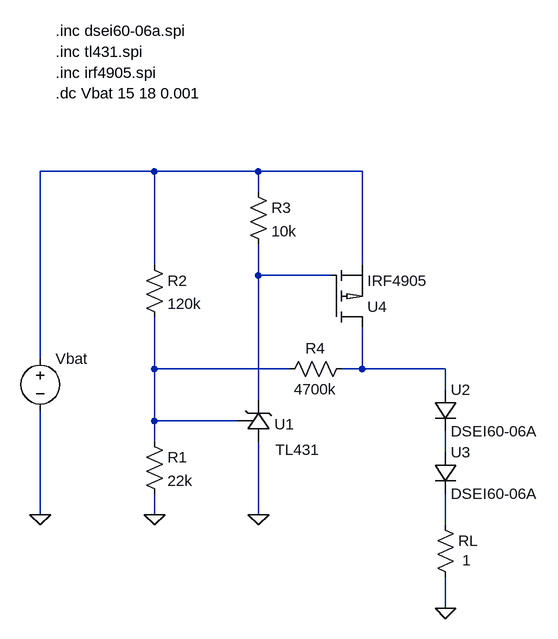
[diagram p0: schematic lipo_5s_protect.asc]
lipo_5s_protect.asc, the LTspice schematic file:
Version 4
SHEET 1 880 680
WIRE -48 -80 -224 -80
WIRE 112 -80 -48 -80
WIRE 272 -80 112 -80
WIRE 112 -48 112 -80
WIRE -48 64 -48 -80
WIRE 272 64 272 -80
WIRE 112 80 112 32
WIRE 224 80 112 80
WIRE -224 208 -224 -80
WIRE -48 224 -48 144
WIRE 160 224 -48 224
WIRE 272 224 272 160
WIRE 272 224 240 224
WIRE 400 224 272 224
WIRE 400 256 400 224
WIRE 112 272 112 80
WIRE -48 304 -48 224
WIRE 80 304 -48 304
WIRE -48 336 -48 304
WIRE 400 352 400 320
WIRE -224 448 -224 288
WIRE -48 448 -48 416
WIRE 112 448 112 336
WIRE 400 464 400 416
WIRE 400 592 400 544
FLAG 400 592 0
FLAG -48 448 0
FLAG 112 448 0
FLAG -224 448 0
SYMBOL res -64 320 R0
SYMATTR InstName R1
SYMATTR Value 22k
SYMBOL res -64 48 R0
SYMATTR InstName R2
SYMATTR Value 120k
SYMBOL res 96 -64 R0
SYMATTR InstName R3
SYMATTR Value 10k
SYMBOL res 384 448 R0
WINDOW 3 42 70 Left 2
SYMATTR Value 1
SYMATTR InstName RL
SYMBOL res 256 208 R90
WINDOW 0 0 56 VBottom 2
WINDOW 3 32 56 VTop 2
SYMATTR InstName R4
SYMATTR Value 4700k
SYMBOL TL431 96 272 R0
WINDOW 0 41 37 Left 2
WINDOW 3 42 76 Left 2
SYMATTR InstName U1
SYMBOL voltage -224 192 R0
WINDOW 123 0 0 Left 0
WINDOW 39 0 0 Left 0
WINDOW 3 24 44 Left 2
SYMATTR Value ""
SYMATTR InstName Vbat
SYMBOL dsei60-06a 384 256 R0
SYMATTR InstName U2
SYMBOL dsei60-06a 384 352 R0
SYMATTR InstName U3
SYMBOL irf4905 224 160 M180
SYMATTR InstName U4
TEXT -200 -200 Left 2 !.dc Vbat 15 18 0.001
TEXT -200 -232 Left 2 !.inc irf4905.spi
TEXT -200 -264 Left 2 !.inc tl431.spi
TEXT -200 -296 Left 2 !.inc dsei60-06a.spi

The netlist it stands for:
* lipo_5s_protect.asc
R1 N003 0 22k
R2 N001 N003 120k
R3 N001 N002 10k
RL N006 0 1
R4 N004 N003 4700k
XU1 0 N002 N003 TL431  ; pins A K R
Vbat N001 0
XU2 N004 N005 DSEI60-06A  ; pins + -
XU3 N005 N006 DSEI60-06A  ; pins + -
XU4 N004 N002 N001 IRF4905  ; pins D G S
.dc Vbat 15 18 0.001
.inc irf4905.spi
.inc tl431.spi
.inc dsei60-06a.spi
.backanno
.end